# Altium schematic sheet Audio.SchDoc
size A4; Revision: C.2(PCB.SCH)
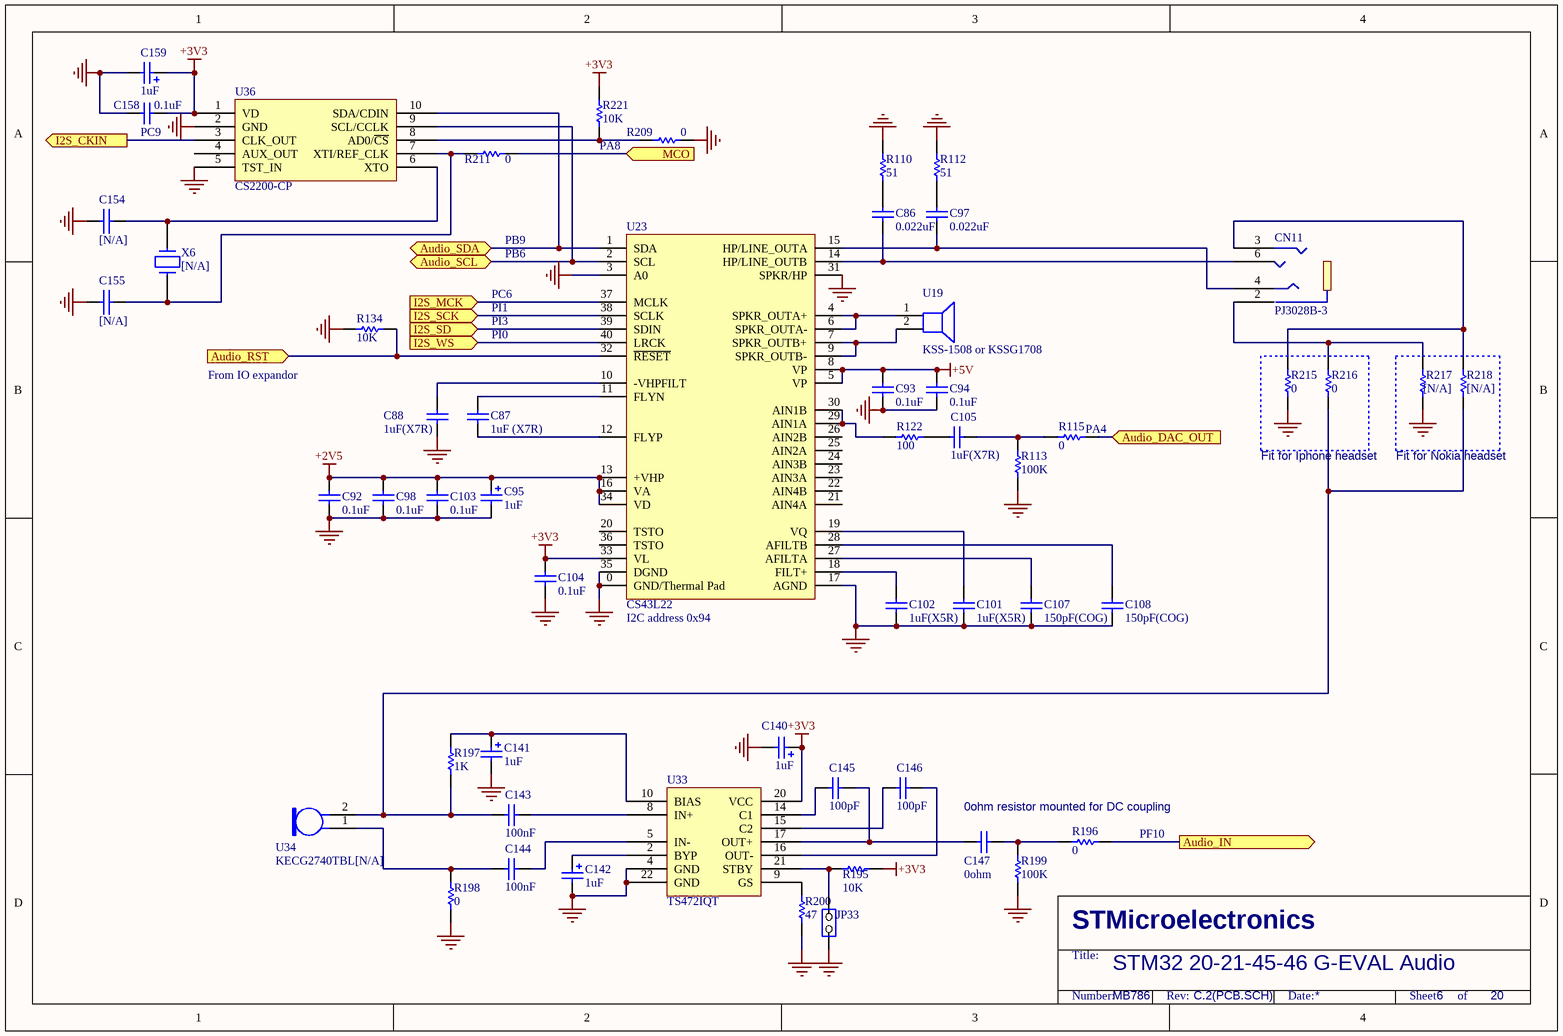
[diagram p0: Audio.SchDoc]

## Parts
C86  0.022uF  [0603C]
C87  1uF (X7R)  [0603C]
C88  1uF(X7R)  [0603C]
C92  0.1uF  [0402C]
C93  0.1uF  [0402C]
C94  0.1uF  [0402C]
C95  1uF  [TAN-A]
C97  0.022uF  [0603C]
C98  0.1uF  [0402C]
C101  1uF(X5R)  [0603C]
C102  1uF(X5R)  [0603C]
C103  0.1uF  [0402C]
C104  0.1uF  [0402C]
C105  1uF(X7R)  [0603C]
C107  150pF(COG)  [0603C]
C108  150pF(COG)  [0603C]
C140  1uF  [TAN-A]
C141  1uF  [TAN-A]
C142  1uF  [TAN-A]
C143  100nF  [0402C]
C144  100nF  [0402C]
C145  100pF  [0402C]
C146  100pF  [0402C]
C147  0ohm  [0603C]
C154  [N/A]  [0603C]
C155  [N/A]  [0603C]
C158  0.1uF  [0402C]
C159  1uF  [TAN-A]
CN11  PJ3028B-3
JP33  (no value)  [SIP2]
R110  51  [0603R]
R112  51  [0603R]
R113  100K  [0402R]
R115  0  [0603R]
R122  100  [0603R]
R134  10K  [0402R]
R195  10K  [0402R]
R196  0  [0603R]
R197  1K  [0603R]
R198  0  [0603R]
R199  100K  [0402R]
R200  47  [0603R]
R209  0  [0603R]
R211  0  [0603R]
R215  0  [0603R]
R216  0  [0603R]
R217  [N/A]  [0603R]
R218  [N/A]  [0603R]
R221  10K  [0402R]
U19  KSS-1508 or KSSG1708  [KS1708]
U23  CS43L22  [QFN40(6*6)]
U33  TS472IQT  [QFN24(4X4)]
U34  KECG2740TBL[N/A]  [KEC2740]
U36  CS2200-CP
X6  [N/A]  [XTAL_socket]

## Ports
Audio_DAC_OUT (in), Audio_IN (out), Audio_RST (in), Audio_SCL (bidir), Audio_SDA (bidir), I2S_CKIN (out), I2S_MCK (in), I2S_SCK (in), I2S_SD (in), I2S_WS (in), MCO (in)

## Nets
+2V5: C92.2 C95.1 C98.2 C103.2 U23.13(+VHP) U23.16(VA) U23.34(VD)
+3V3: C104.2 C140.1 C158.1 C159.1 R195.1 R221.1 U23.33(VL) U33.20(VCC) U36.1(VD)
+5V: C93.1 C94.1 U23.5(VP) U23.8(VP)
GND: C88.2 C92.1 C93.2 C94.2 C95.2 C98.1 C101.1 C102.1 C103.1 C104.1 C107.1 C108.1 C140.2 C141.2 C142.2 C154.2 C155.2 C158.2 C159.2 JP33.1(COMMON) R110.1 R112.1 R113.2 R134.2 R198.1 R199.1 R200.1 R209.1 R215.1 R217.1 U23.0(GND/Thermal_Pad) U23.3(A0) U23.17(AGND) U23.31(SPKR/HP) U23.35(DGND) U33.4(GND) U33.22(GND) U36.2(GND) U36.5(TST_IN)
Audio_DAC_OUT: R115.2 ; port Audio_DAC_OUT
Audio_IN: R196.1 ; port Audio_IN
Audio_RST: R134.1 U23.32(~{RESET}) ; port Audio_RST
Audio_SCL: U23.2(SCL) U36.9(SCL/CCLK) ; port Audio_SCL
Audio_SDA: U23.1(SDA) U36.10(SDA/CDIN) ; port Audio_SDA
I2S_CKIN: U36.3(CLK_OUT) ; port I2S_CKIN
I2S_MCK: U23.37(MCLK) ; port I2S_MCK
I2S_SCK: U23.38(SCLK) ; port I2S_SCK
I2S_SD: U23.39(SDIN) ; port I2S_SD
I2S_WS: U23.40(LRCK) ; port I2S_WS
MCO: R211.1 ; port MCO
NetC86_1: C86.1 R110.2
NetC86_2: C86.2 CN11.6 U23.14(HP/LINE_OUTB)
NetC87_1: C87.1 U23.12(FLYP)
NetC87_2: C87.2 U23.11(FLYN)
NetC88_1: C88.1 U23.10(-VHPFILT)
NetC97_1: C97.1 R112.2
NetC97_2: C97.2 CN11.4 U23.15(HP/LINE_OUTA)
NetC101_2: C101.2 U23.19(VQ)
NetC102_2: C102.2 U23.18(FILT+)
NetC105_1: C105.1 R122.1
NetC105_2: C105.2 R113.1 R115.1
NetC107_2: C107.2 U23.27(AFILTA)
NetC108_2: C108.2 U23.28(AFILTB)
NetC141_1: C141.1 R197.2 U33.10(BIAS)
NetC142_1: C142.1 U33.2(BYP)
NetC143_1: C143.1 R197.1 R216.1 R218.1 U34.2
NetC143_2: C143.2 U33.8(IN+)
NetC144_1: C144.1 R198.2 U34.1
NetC144_2: C144.2 U33.5(IN-)
NetC145_1: C145.1 C147.2 U33.17(OUT+)
NetC145_2: C145.2 U33.14(C1)
NetC146_1: C146.1 U33.16(OUT-)
NetC146_2: C146.2 U33.15(C2)
NetC147_1: C147.1 R196.2 R199.2
NetC154_1: C154.1 U36.6(XTO) X6.2
NetC155_1: C155.1 R211.2 U36.7(XTI/REF_CLK) X6.1
NetCN11_2: CN11.2 R216.2 R217.2
NetCN11_3: CN11.3 R215.2 R218.2
NetJP33_2: JP33.2(NO) R195.2 U33.21(STBY)
NetR122_2: R122.2 U23.29(AIN1A) U23.30(AIN1B)
NetR200_2: R200.2 U33.9(GS)
NetR209_2: R209.2 R221.2 U36.8(AD0/~{CS})
NetU19_1: U19.1(+) U23.4(SPKR_OUTA+) U23.6(SPKR_OUTA-)
NetU19_2: U19.2(-) U23.7(SPKR_OUTB+) U23.9(SPKR_OUTB-)

Not connected (* = marked no-connect by the designer): U23 20(TSTO) 21(AIN4A) 22(AIN4B) 23(AIN3A) 24(AIN3B) 25(AIN2A) 26(AIN2B) 36(TSTO); U36 4(AUX_OUT)

## Notes on the sheet
- (near C158) PC9
- (near R221) PA8
- PB9
- PC6
- PI1
- PB6
- From IO expandor
- PI0
- PI3
- (near R115) PA4
- Fit for Iphone headset
- Fit for Nokia headset
- (near U23) I2C address 0x94
- 0ohm resistor mounted for DC coupling
- (near R196) PF10
- STM32 20-21-45-46 G-EVAL Audio
- MB786
- 6
- 20
- STMicroelectronics
- Title:
- Number:
- Rev:
- Date:
- Sheet       of

## Library data of the parts
C86-C88 C92-C94 C97 C98 C101-C105 C107 C108 C158 = CAP: Capacitor; Value: 100nF; Published: 8-Jun-2000; Revision: July-2002: Re-released for DXP Platform.; Publisher: Altium Limited
C95 C159 = Cap Pol1: Polarized Capacitor (Radial); Value: 47uF; Published: 8-Jun-2000; Revision: July-2002: Re-released for DXP Platform.; Publisher: Altium Limited
C140-C142 = Cap Pol1: Polarized Capacitor (Radial); Value: 100pF; Published: 8-Jun-2000; Revision: July-2002: Re-released for DXP Platform.; Publisher: Altium Limited
C143 C144 C147 = CAP: Capacitor; Value: 100pF; Published: 8-Jun-2000; Revision: July-2002: Re-released for DXP Platform.; Publisher: Altium Limited
C145 C146 C154 C155 = CAP: Capacitor
  C145 C146: Published: 8-Jun-2000; Revision: July-2002: Re-released for DXP Platform.; Publisher: Altium Limited; Value: 100pF
JP33 = JP2
R110 R112 R113 R115 R122 R134 R209 R211 R215-R218 = res1: Resistor; Value: 1K; Published: 8-Jun-2000; Revision: July-2002: Re-released for DXP Platform.; Publisher: Altium Limited
R195 R196 R198-R200 R221 = Res1: Resistor; Value: 1K; Published: 8-Jun-2000; Revision: July-2002: Re-released for DXP Platform.; Publisher: Altium Limited
R197 = Res1: Resistor; Published: 8-Jun-2000; Revision: July-2002: Re-released for DXP Platform.; Publisher: Altium Limited; Value: 1K
U19 = Speaker: Loudspeaker; Published: 24-Mar-1999; Revision: July-2002: Re-released for DXP Platform.; Publisher: Altium Limited
U34 = Mic2: Microphone; Published: 24-Mar-1999; Revision: July-2002: Re-released for DXP Platform.; Publisher: Altium Limited
X6 = CRYSTAL